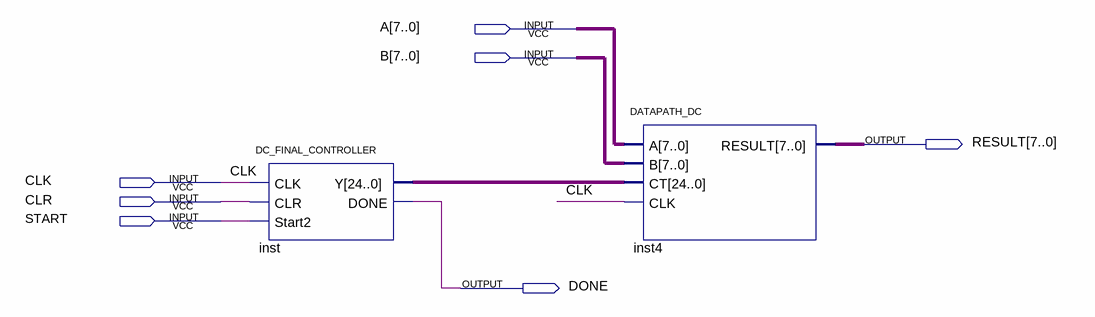
[diagram p0: schematic sheet]
// Quartus schematic DC_FINAL.bdf as structural Verilog: 2 symbols, 7 pins
module DC_FINAL (
  input  [7:0] A,
  input  [7:0] B,
  input  CLK,
  input  CLR,
  input  START,
  output [7:0] RESULT,
  output DONE
);

  wire [24:0] inst_y;

  DC_FINAL_CONTROLLER inst (.CLK(CLK), .CLR(CLR), .Start2(START), .Y(inst_y), .DONE(DONE));
  DATAPATH_DC inst4 (.A(A), .B(B), .CT(inst_y), .CLK(CLK), .RESULT(RESULT));
endmodule
